# Altium schematic sheet 06_ESP.SchDoc
size A; SheetNumber: 6; SheetTotal: 8
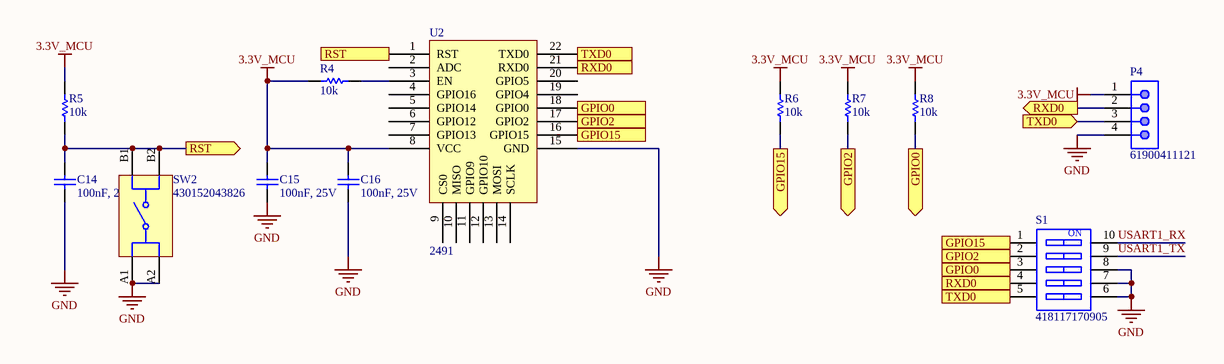
[diagram p0: 06_ESP.SchDoc]

## Parts
C14  100nF, 25V  [WCAP-CSGP_0603_H=0.8mm_Reflow]
C15  100nF, 25V  [WCAP-CSGP_0603_H=0.8mm_Reflow]
C16  100nF, 25V  [WCAP-CSGP_0603_H=0.8mm_Reflow]
P4  61900411121  [61900411121]
R4  value 10k  [RES-SM-0603]  (hidden comment: ESR03EZPF1002)
R5  value 10k  [RES-SM-0603]  (hidden comment: ESR03EZPF1002)
R6  value 10k  [RES-SM-0603]  (hidden comment: ESR03EZPF1002)
R7  value 10k  [RES-SM-0603]  (hidden comment: ESR03EZPF1002)
R8  value 10k  [RES-SM-0603]  (hidden comment: ESR03EZPF1002)
S1  418117170905  [418117170905]
SW2  430152043826  [WS-TASV_L6W6H4.3_4301x20438x6]
U2  2491  [ESP8266]

## Ports
GPIO0 (in), GPIO0 (out), GPIO2 (in), GPIO2 (out), GPIO15 (in), GPIO15 (out), RST (in), RST (out), RXD0 (in), RXD0 (out), TXD0 (in), TXD0 (out)

## Nets
3.3V_MCU: C15.2 C16.2 P4.1 R4.1 R5.1 R6.1 R7.1 R8.1 U2.8(VCC)
GND: C14.1 C15.1 C16.1 P4.4 S1.6 S1.7 S1.8 SW2.A1 SW2.A2 U2.15(GND)
GPIO0: R8.2 S1.3 U2.18(GPIO0) ; port GPIO0
GPIO2: R7.2 S1.2 U2.17(GPIO2) ; port GPIO2
GPIO15: R6.2 S1.1 U2.16(GPIO15) ; port GPIO15
RST: C14.2 R5.2 SW2.B1 SW2.B2 U2.1(RST) ; port RST
RXD0: P4.2 S1.4 U2.21(RXD0) ; port RXD0
TXD0: P4.3 S1.5 U2.22(TXD0) ; port TXD0
USART1_RX: S1.10
USART1_TX: S1.9
NetR4_2: R4.2 U2.3(EN)

Not connected (* = marked no-connect by the designer): U2 2(ADC) 4(GPIO16) 5(GPIO14) 6(GPIO12) 7(GPIO13) 9(CS0) 10(MISO) 11(GPIO9) 12(GPIO10) 13(MOSI) 14(SCLK) 19(GPIO4) 20(GPIO5)

## Notes on the sheet
- (in symbol 418117170905) ON

## Library data of the parts
C14-C16 = 885012206071: WCAP-CSGP Multilayer Ceramic Chip Capacitor, General Purpose, size 0603, X7R, 100nF, 25V; Manufacturer: Wurth Elektronik; Rated Voltage: 25VDC; Isolation Resistance: >=5GOhm; Capacitance Tolerance: +/-10%; Technical Reference: X7R0603104K025DFCT10000; No. Pad (SMD): 2; No. Pad (THT): 0; ComponentLink1Description: Manufacturer; ComponentLink1URL: http://www.we-online.de; ComponentLink2Description: Datasheet; ComponentLink2URL: https://www.we-online.com/catalog/datasheet/885012206071.pdf; Operating Temperature: -55 to +125degC; Packaging: Tape and Reel; Manufacturer Part Number: 885012206071; Published Date: May 2020; Ceramic Type: X7R; Dissipation Factor: =<3.5%; Height: 0.8mm; Mounting Technology: SMT; Size: 0603; Capacitance: 100nF; Unit Price (Digikey): 0.1
P4 = 61900411121: WR-WTB THT Male Vertical Locking Header, pitch 2.54mm, 4p; Pin Number: 4; Contact Resistance: 20mOhm; Rated Current: 3A; Withstanding Voltage: 1000VAC; Working Voltage: 250VAC; No. Pad (SMD): 0; ComponentLink1Description: Manufacturer; ComponentLink1URL: http://www.we-online.de; ComponentLink2Description: Datasheet; ComponentLink2URL: https://www.we-online.com/catalog/datasheet/61900411121.pdf; Pitch: 2.54mm; Published Date: January 2020; Publisher: Wurth Elektronik; Mounting Technology: THT; Packaging: Bag; Operating Temperature: -40 to +105degC; Part Number: 61900411121; Gender: Male; Type: Vertical; No. Pad (THT): 4; Unit Price (Digikey): 0.94
R4-R8 = RESISTOR SMD: RES SMD 10K OHM 1% 1/4W 0603; Mfr: Rohm Semiconductor; No. Pad (SMD): 2; No. Pad (THT): 0; Resistance: 10 kOhms; Power (Watts): 0.25W, 1/4W; Temperature Coefficient: ±100ppm/°C; Ratings: AEC-Q200*; Unit Price (Digikey): 0.15; Category: Resistors; Series: ESR; Tolerance: ±1%; Composition: Thick Film; Features: Automotive AEC-Q200, Pulse Withstanding; Operating Temperature: -55°C ~ 155°C; Package / Case: 0603 (1608 Metric); Supplier Device Package: 0603; Size / Dimension: 0.063" L x 0.031" W (1.60mm x 0.80mm); Height - Seated (Max): 0.022" (0.55mm); Number of Terminations: 2
S1 = 418117170905: WS-DITV Compact THT Dip Switch, Flat Actuator, pitch 2.54mm, 5p; Operation Force: 800g; Pole Number: 5; Actuator Type: Flat Type; Circuit: SPST-NO; Rated Current Switching: 25mA; Rated Current Non-Switching: 100mA; Rated Voltage Non-Switching: 50VDC; Rated Voltage Switching: 24VDC; No. Pad (SMD): 0; No. Pad (THT): 10; ComponentLink1Description: Manufacturer; ComponentLink1URL: http://www.we-online.de; ComponentLink2Description: Datasheet; ComponentLink2URL: https://katalog.we-online.com/em/datasheet/418117170905.pdf; Pitch: 2.54mm; Contact Material: Copper Alloy; Mounting Technology: THT; Operating Temperature: -40 to +85degC; Contact Plating: Gold; Packaging: Tube; Part Number: 418117170905; Publisher: Wurth Elektronik; Published Date: September 2019; Unit Price (Digikey): 2.13
SW2 = 430152043826: WS-TASV SMT Tact Switch, 12VDC, 50mA, 260g, height 4.3mm; Manufacturer: Wurth Elektronik; Rated Voltage: 12V; Washable: No; Actuator Color: White; Electrical Life: 200000Cycles; No. Pad (SMD): 4; No. Pad (THT): 0; ComponentLink1Description: Manufacturer Link; ComponentLink1URL: http://www.we-online.de; ComponentLink2Description: Datasheet; ComponentLink2URL: https://www.we-online.com/catalog/datasheet/430152043826.pdf; Manufacturer Part Number: 430152043826; Contact Material: Stainless Steel; Mounting Technology: SMT; Contact Plating: Silver; Operation Force: 260g; Packaging: Tape and Reel; Terminal Material: Copper Alloy; Rated Current: 50mA; Terminal Plating: Silver; Height: 4.3mm; Length: 6mm; Operating Temperature max.: 85C; Operating Temperature min.: -40C; Width: 6mm; Unit Price (Digikey): 0.53
U2 = ESP8266: WiFi 802.11b/g/n Transceiver Module 2.4GHz ~ 2.5GHz Integrated, Trace Surface Mount; Mfr: Adafruit Industries LLC; No. Pad (SMD): 22; No. Pad (THT): 0; Data Rate: 72.2Mbps; Power - Output: 20.5dBm; Sensitivity: -98dBm; Serial Interfaces: I²C, I²S, SDIO, SPI, UART; Memory Size: 4MB Flash; Voltage - Supply: 3V ~ 3.6V; Current - Receiving: 50mA ~ 56mA; Current - Transmitting: 120mA ~ 170mA; Unit Price (Digikey): 6.95; ComponentLink1Description: Digikey; ComponentLink1URL: https://www.digikey.com/en/products/detail/adafruit-industries-llc/2491/5761206; Category: RF/IF and RFID; RF Family/Standard: WiFi; Protocol: 802.11b/g/n; Frequency: 2.4GHz ~ 2.5GHz; Antenna Type: Integrated, Trace; Utilized IC / Part: ESP8266; Mounting Type: Surface Mount; Operating Temperature: -40°C ~ 125°C; Package / Case: Module